# Altium project MAT_Dual028CCSeg2SW.PrjPcb
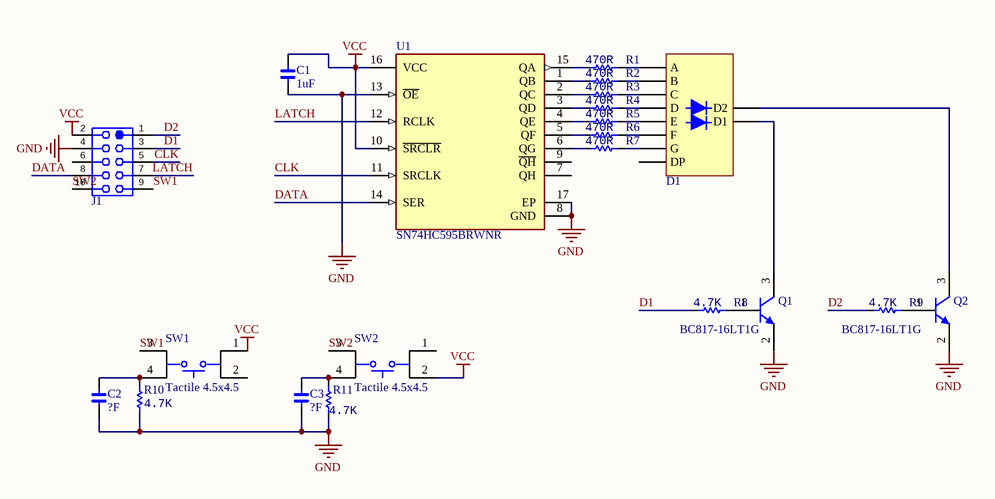
[diagram p0: Sheet.SchDoc]
1 sheet, 21 parts. Net scope: global (net labels, ports and power ports of the same name join across sheets).
Board file: PCB.PcbDoc

## Sheet Sheet.SchDoc
size A; SheetNumber: 1; SheetTotal: 1

### Parts
C1  1uF  [C0603C-IPC_B]
C2  ?F  [C0603C-IPC_B]
C3  ?F  [C0603C-IPC_B]
D1  7SEG_028_DUAL_CC  [7seg_2digit_028inch]  (value not drawn)
J1  HDRM_2x5_127_90  [HDRM_2x05J_90]  (value not drawn)
Q1  BC817-16LT1G  [ONSC-SOT-23-3-318-08_V]
Q2  BC817-16LT1G  [ONSC-SOT-23-3-318-08_V]
R1  Resistance: 470R  [RC0603-IPC_B]  (hidden comment: RC-0603)
R2  Resistance: 470R  [RC0603-IPC_B]  (hidden comment: RC-0603)
R3  Resistance: 470R  [RC0603-IPC_B]  (hidden comment: RC-0603)
R4  Resistance: 470R  [RC0603-IPC_B]  (hidden comment: RC-0603)
R5  Resistance: 470R  [RC0603-IPC_B]  (hidden comment: RC-0603)
R6  Resistance: 470R  [RC0603-IPC_B]  (hidden comment: RC-0603)
R7  Resistance: 470R  [RC0603-IPC_B]  (hidden comment: RC-0603)
R8  Resistance: 4.7K  [RC0603-IPC_B]  (hidden comment: RC-0603)
R9  Resistance: 4.7K  [RC0603-IPC_B]  (hidden comment: RC-0603)
R10  Resistance: 4.7K  [RC0603-IPC_B]  (hidden comment: RC-0603)
R11  Resistance: 4.7K  [RC0603-IPC_B]  (hidden comment: RC-0603)
SW1  Tactile 4.5x4.5  [Tactile_45x45_SMD]
SW2  Tactile 4.5x4.5  [Tactile_45x45_SMD]
U1  SN74HC595BRWNR  [FP-RWN0016A-MFG]

### Nets
GND: C1.1 C2.1 C3.1 J1.4 Q1.2(E) Q2.2(E) R10.1 R11.1 U1.8(GND) U1.13(~{OE}) U1.17(EP)
VCC: C1.2 J1.2 SW1.1 SW2.2 U1.10(~{SRCLR}) U1.16(VCC)
CLK: J1.5 U1.11(SRCLK)
D1: J1.3 R8.1
D2: J1.1 R9.1
DATA: J1.8 U1.14(SER)
LATCH: J1.7 U1.12(RCLK)
SW1: J1.9 SW1.3
SW2: J1.10 SW2.3
NetC2_2: C2.2 R10.2 SW1.4
NetC3_2: C3.2 R11.2 SW2.4
NetD1_1: D1.1(E) R5.2
NetD1_2: D1.2(D) R4.2
NetD1_3: D1.3(C) R3.2
NetD1_4: D1.4(G) R7.2
NetD1_6: D1.6(D2) Q2.3(C)
NetD1_7: D1.7(A) R1.2
NetD1_8: D1.8(B) R2.2
NetD1_9: D1.9(D1) Q1.3(C)
NetD1_10: D1.10(F) R6.2
NetQ1_1: Q1.1(B) R8.2
NetQ2_1: Q2.1(B) R9.2
NetR1_1: R1.1 U1.15(QA)
NetR2_1: R2.1 U1.1(QB)
NetR3_1: R3.1 U1.2(QC)
NetR4_1: R4.1 U1.3(QD)
NetR5_1: R5.1 U1.4(QE)
NetR6_1: R6.1 U1.5(QF)
NetR7_1: R7.1 U1.6(QG)

Not connected (* = marked no-connect by the designer): D1 5(DP); J1 6; SW1 2; SW2 1; U1 7(QH) 9(~{QH})

### Library data of the parts
C1 = Cap_0603: 0603 Multilayer Ceramic Capacitors MLCC - SMD/SMT ROHS; Voltage Rated: 25V; Value: 1uF
C2 C3 = Cap_0603: 0603 Multilayer Ceramic Capacitors MLCC - SMD/SMT ROHS; Voltage Rated: ?V; Value: ?F
D1 = 2821AS: Common-Cathode (CC); Datasheet: https://www.thegioiic.com/sn410281n-led-7-doan-0-28inch-do-2-so-duong-chung
J1 = HDRM_2x5_127_90: Gold 250V 1A Shrouded Square Pins 1mm 260? 4mm -40?~+105? 6 1.27mm Brass Black 2x5P 1.27mm Push-Pull,P=1.27mm Pin Headers ROHS
Q1 Q2 = CMP-1048-00736-1: General Purpose Transistor, NPN Silicon, 3-Pin SOT-23, Pb-Free, Tape and Reel; Manufacturer: On Semiconductor; IC Continuous (A): 0.5; fT Min (MHz): 100; PartNumber: BC817-16LT1G; Mounting Technology: Surface Mount; PackageVersion: Rev. AP, 11/2009; ComponentLink3Description: Package Specification; PackageReference: SOT-23-3-318-08; Packing: Tape and Reel; ComponentLink1URL: http://www.onsemi.com/; Polarity: NPN; RoHS: TRUE; ComponentLink2URL: http://www.onsemi.com/pub_link/Collateral/BC817-16LT1-D.PDF; ComponentLink3URL: http://www.onsemi.cn/pub_link/Collateral/318-08.PDF; ComponentLink2Description: Datasheet; PackageDescription: 3-Pin Small Outline Transistor, Body 2.92 x 1.3 mm, Pitch 0.95 mm; ComponentLink1Description: Manufacturer URL; DatasheetVersion: Rev. 12
R1-R11 = RC-0603: ±1% 0603 Chip Resistor - Surface Mount ROHS; Power(Watts): 100mW; Package: 0603; Type: Thick Film Resistors; Tolerance: ±1%; Operating Temperature Range: -55℃~+155℃
SW1 SW2 = Tactile 4.5x4.5: SWITCH TACTILE SPST-NO 50MA 12V; Actuator Type: Standard; Illumination Type: Non-Illuminated; Mechanical Life: 500000Cycles; Switch Function: Off-Mom; Switch Travel: 0.2mm; Operating Force: 160gf; Throw Configuration: SPST; Lead Free: Lead Free; Packaging: Tape and Reel; Termination: Gull Wing; Max Operating Temperature: 70°C; Min Operating Temperature: -20°C; Mount: Surface Mount
U1 = CMP-04904-000008-1: IC SHIFT REGISTER 8BIT 16X1QFN; Min Supply Voltage: 2V; Number of Elements: 1; Max Supply Voltage: 6V; Number of Bits per Element: 8; REACH SVHC: No SVHC; Lead Free: Lead Free; Min Operating Temperature: -55°C; Number of Pins: 16; Logic Function: Shift Register; Mount: Surface Mount; Max Operating Temperature: 125°C; Packaging: Cut Tape; RoHS Compliant: Yes